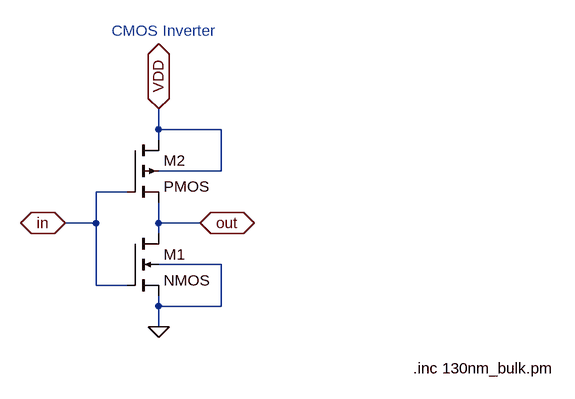
[diagram p0: schematic inverter.asc]
inverter.asc, the LTspice schematic file:
Version 4
SHEET 1 880 680
WIRE 208 80 208 48
WIRE 304 80 208 80
WIRE 208 96 208 80
WIRE 304 144 304 80
WIRE 304 144 208 144
WIRE 160 176 112 176
WIRE 112 224 112 176
WIRE 112 224 64 224
WIRE 208 224 208 192
WIRE 272 224 208 224
WIRE 208 240 208 224
WIRE 304 288 208 288
WIRE 112 320 112 224
WIRE 160 320 112 320
WIRE 208 352 208 336
WIRE 304 352 304 288
WIRE 304 352 208 352
WIRE 208 384 208 352
FLAG 208 384 0
FLAG 64 224 in
IOPIN 64 224 BiDir
FLAG 272 224 out
IOPIN 272 224 BiDir
FLAG 208 48 VDD
IOPIN 208 48 BiDir
SYMBOL nmos4 160 240 R0
SYMATTR InstName M1
SYMATTR Value2 l=130n w=2u
SYMBOL pmos4 160 96 R0
SYMATTR InstName M2
SYMATTR Value2 l=130n w=6u
TEXT 600 448 Left 2 !.inc 130nm_bulk.pm
TEXT 136 -72 Left 2 ;CMOS Inverter

The netlist it stands for:
* inverter.asc
M1 out in 0 0 NMOS l=130n w=2u
M2 VDD in out VDD PMOS l=130n w=6u
.model NMOS NMOS
.model PMOS PMOS
.lib standard.mos
.inc 130nm_bulk.pm
* CMOS Inverter
.backanno
.end